# Altium schematic sheet 5 Com channel.SchDoc
size A4; Organization: Altium Limited; Address1: L3, 12a Rodborough Rd; Address2: Frenchs Forest; Address3: NSW; Address4: Australia 2086; DocumentNumber: 5; SheetNumber: 5; SheetTotal: 5
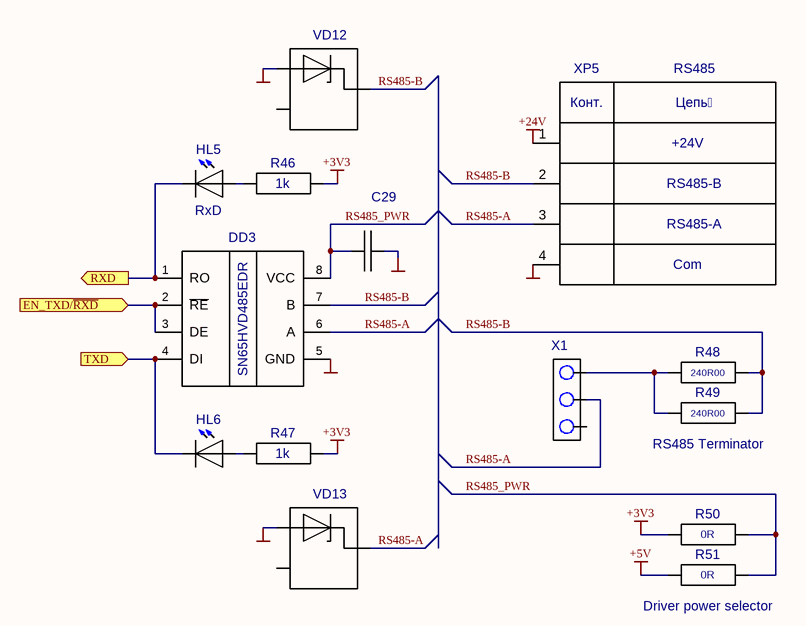
[diagram p0: 5 Com channel.SchDoc]

## Parts
C29  C0402  [0402_CAP]  (value not drawn)
DD3  value SN65HVD485EDR  [SO8]  (hidden comment: ADM485AR)
HL5  KP-2012MGC  [KP-2012_GRN]  (value not drawn)
HL6  KP-2012SYC  [KP-2012_YEL]  (value not drawn)
R46  value 1k  [0603_RES]  (hidden comment: R0603)
R47  value 1k  [0603_RES]  (hidden comment: R0603)
R48  value 240R00  [0805_RES]  (hidden comment: R0805)
R49  value 240R00  [0805_RES]  (hidden comment: R0805)
R50  0R  [0402_RES]
R51  0R  [0402_RES]
VD12  GSOT12-E3-08  [SOT-23-(2)]  (value not drawn)
VD13  GSOT12-E3-08  [SOT-23-(2)]  (value not drawn)
X1  DS1025-01-1*3 P8BV1  [PLS2-3]  (value not drawn)
XP5  PH-4  [PH-4]  (value not drawn)  (parts A,B,C,D of 4)

## Ports
EN_TXD/~{RXD} (in), RXD (out), TXD (in)

## Nets
+3V3: R46.1 R47.1 R50.2
+5V: R51.2
+24V: XP5.1
GND: C29.1 DD3.5(GND) VD12.1 VD13.1 XP5.4
EN_TXD/~{RXD}: DD3.2(~{RE}) DD3.3(DE) ; port EN_TXD/~{RXD}
RS485-A: DD3.6(A) VD13.3 X1.2 XP5.3
RS485-B: DD3.7(B) R48.1 R49.1 VD12.3 XP5.2
RS485_PWR: C29.2 DD3.8(VCC) R50.1 R51.1
RXD: DD3.1(RO) HL5.2(K) ; port RXD
TXD: DD3.4(DI) HL6.2(K) ; port TXD
NetHL5_1: HL5.1(A) R46.2
NetHL6_1: HL6.1(A) R47.2
NetR48_2: R48.2 R49.2 X1.1

Not connected (* = marked no-connect by the designer): VD12 2; VD13 2; X1 3

## Notes on the sheet
- (near XP5) Конт.
- XP5
- Цепь
- RS485
- +24V
- RS485-B
- (near HL5) RxD
- Com
- RS485-A
- (near R49) RS485 Terminator
- (near R51) Driver power selector
- Title
- Size:
- Date:
- A4
- Number:
- Time:
- Revision:
- Sheet
- of
- File:

## Library data of the parts
C29 = C0402: Value: µ10x10V X7R
HL5 HL6 = KP-2012
  HL5: Value: KP-2012MGC
  HL6: Value: KP-2012SYC
R50 R51 = R0402: Value: 0R
VD12 VD13 = GSOT12C: Single-line ESD protection device / ± 30 kV contact discharge / ± 30 kV air discharge; Value: GSOT12C
X1 = PLS2-3: Value: DS1025-01-1*3 P8BV1
XP5 = PH-4: Value: B4B-PH-K-S(LF)(SN)